# Altium project PCB_IGBT.PrjPcb
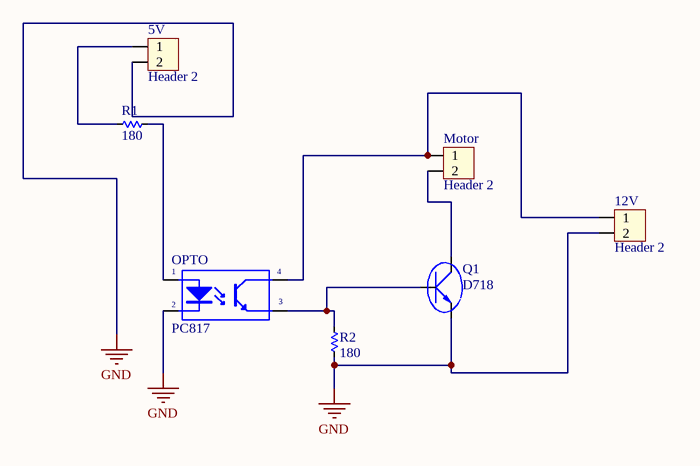
[diagram p0: Sheet1.SchDoc]
1 sheet, 7 parts. Net scope: global (net labels, ports and power ports of the same name join across sheets).
Board file: PCB1.PcbDoc

## Sheet Sheet1.SchDoc
size A; SheetNumber: 1; SheetTotal: 1

### Parts
5V  Header 2  [HED2]
12V  Header 2  [HED2]
Motor  Header 2  [HED2]
OPTO  PC817  [DIP4]
Q1  D718  [QTO-247]
R1  180  [RES-1/2W]
R2  180  [RES-1/2W]

### Nets
GND: 5V.2 12V.2 OPTO.2(K) Q1.3(E) R2.2
Net5V_1: 5V.1 R1.1
Net12V_1: 12V.1 Motor.1 OPTO.4(C)
NetMotor_2: Motor.2 Q1.2(C)
NetOPTO_1: OPTO.1(A) R1.2
NetOPTO_3: OPTO.3(E) Q1.1(B) R2.1

### Library data of the parts
5V 12V Motor = Hed2: Header 2 (Green); Value: Header 2
OPTO = PC817: Single Opto; Value: PC817
Q1 = D718: Transistor Power Supply; Value: D718
R1 R2 = Res: Manufacturer: Generic Components; Class: Passive; SubClass: R; Published: 08/06/2000; Publisher: Altium Hobart Technology Centre